# EAGLE design brd (EAGLE 8.1.0)
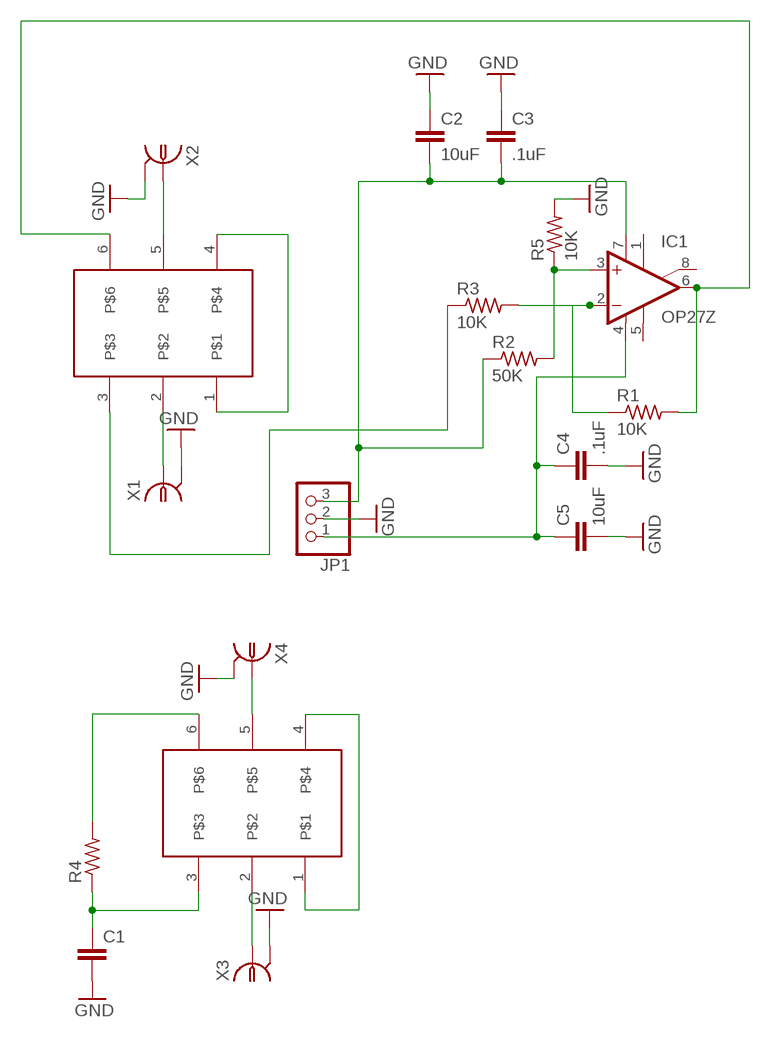
[diagram p0: schematic, sheet 1]

## Parts
C1  C-EU025-024X044  [C025-024X044]
C2  10uF  C-EU025-024X044  [C025-024X044]
C3  .1uF  C-EU025-024X044  [C025-024X044]
C4  .1uF  C-EU025-024X044  [C025-024X044]
C5  10uF  C-EU025-024X044  [C025-024X044]
IC1  OP27Z  [DIL08]
JP1  PINHD-1X3  [1X03]
R1  10K  R-US_0204/2V  [0204V]
R2  50K  R-US_0204/2V  [0204V]
R3  10K  R-US_0204/2V  [0204V]
R4  R-US_0204/2V  [0204V]
R5  10K  R-US_0204/2V  [0204V]
U$1  DP3T-TOGGLE  [7201MD9AV2BE]
U$2  DP3T-TOGGLE  [7201MD9AV2BE]
X1  BNC-H  [BNC90]
X2  BNC-H  [BNC90]
X3  BNC-H  [BNC90]
X4  BNC-H  [BNC90]

## Nets
GND: C1.2 C2.1 C3.1 C4.2 C5.2 JP1.2 R5.2 X1.2 X2.2 X3.2 X4.2
N$1: IC1.2(-IN) R1.1 R3.2
N$2: IC1.6(OUT) R1.2 U$1.6
N$3: C4.1 C5.1 IC1.4(V-) JP1.1
N$4: U$2.2 X3.1
N$5: U$2.5 X4.1
N$6: U$1.2 X1.1
N$7: C2.2 C3.2 IC1.7(V+) JP1.3 R2.1
N$8: C1.1 R4.1 U$2.3
N$9: IC1.3(+IN) R2.2 R5.1
N$10: U$2.1 U$2.4
N$12: U$1.5 X2.1
N$14: R3.1 U$1.3
N$15: U$1.1 U$1.4
N$16: R4.2 U$2.6
Unconnected: IC1.1(ON1) IC1.5(OPT) IC1.8(ON2)

## Library data of the parts
C1-C5 = resistor:C-EU: CAPACITOR, European symbol
IC1 = linear:OP27: OP AMP
JP1 = pinhead:PINHD-1X3: PIN HEADER
R1-R5 = resistor:R-US_: RESISTOR, American symbol
U$1 U$2 = switch-jqi:DP3T-TOGGLE
X1-X4 = connector-jqi:BNC: BNC Connector.; DIGIKEY: A32260-ND

## Board
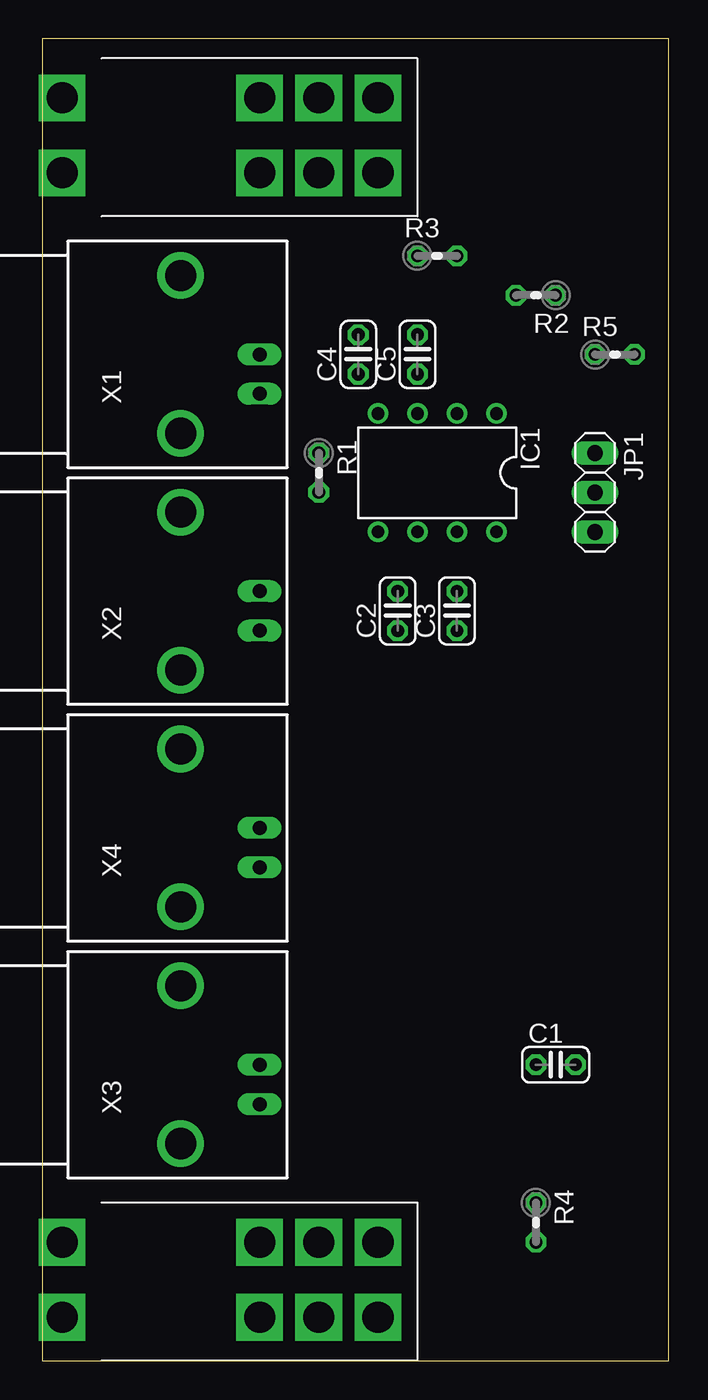
[diagram p1: board, top side]
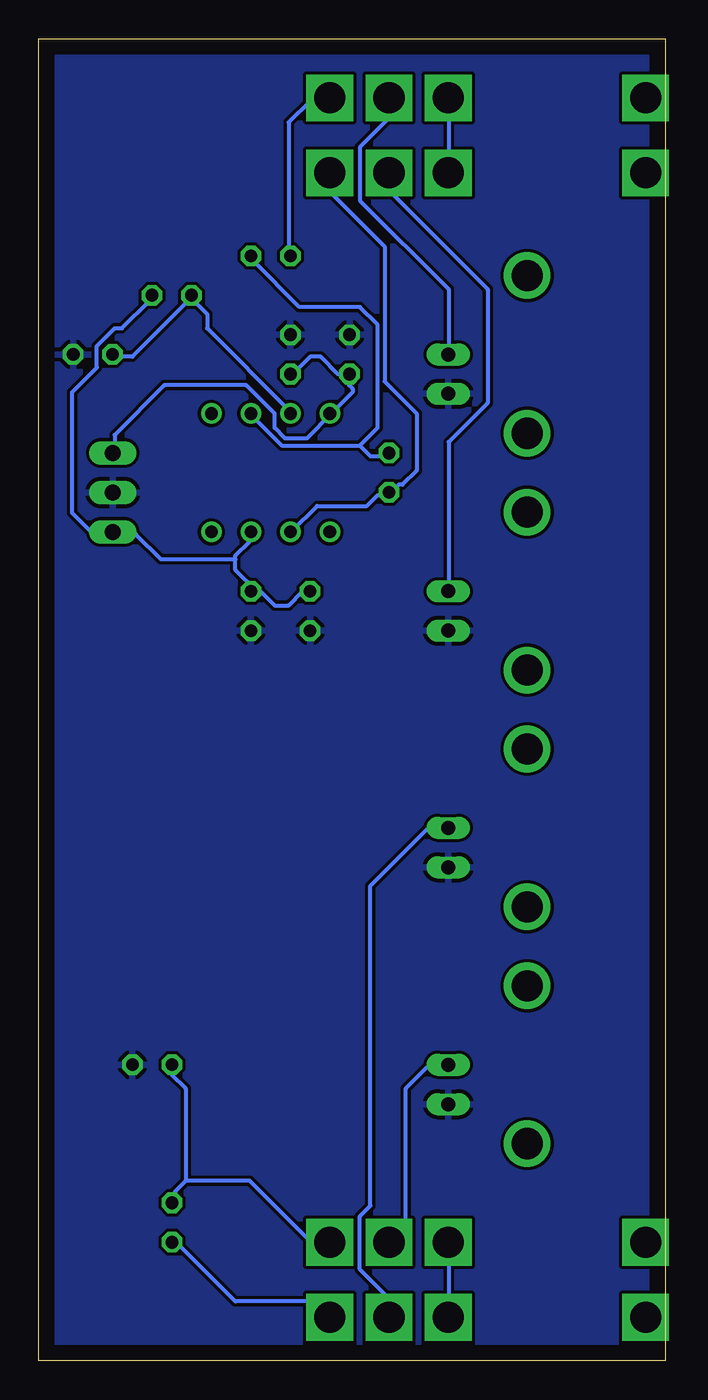
[diagram p2: board, bottom side, seen from below]

Size 40.31 x 85.08 mm. Coordinates in mm from the lower left corner, seen from the top.
Outline: 0,0 40.31,0 40.31,85.08 0,85.08 0,0
Copper layers (1*16): Top 0.035mm / dielectric 1.5mm / Bottom 0.035mm
Design rules "default": minimum track width 10mil, minimum drill 24mil, track to track 8mil, track to pad 8mil, pad to pad 8mil, via to via 8mil, smd to smd 8mil, copper to edge 40mil, drill to drill 8mil, minimum pad ring 10mil, minimum via ring 8mil, stop-mask expansion 4mil, vias tented up to drill 0mil, thermal gap 10mil

### Footprints (pad centres in the part's own frame; a part is rotated, then mirrored left to right if it is on the bottom)
C025-024X044 = drill 0.813 octagon: 1 -1.27,0; 2 1.27,0
DIL08 = drill 0.813 pad 1.27: 1 -3.81,-3.81; 2 -1.27,-3.81; 3 1.27,-3.81; 4 3.81,-3.81; 5 3.81,3.81; 6 1.27,3.81; 7 -1.27,3.81; 8 -3.81,3.81
1X03 = drill 1.016 long: 1 -2.54,0; 2 0,0; 3 2.54,0
0204V = drill 0.813 octagon: 1 -1.27,0; 2 1.27,0
7201MD9AV2BE = drill 2 square: 1 0,0; 2 0,3.81; 3 0,7.62; 4 4.826,0; 5 4.826,3.81; 6 4.826,7.62; P$7 0,-12.7; P$8 4.826,-12.7
BNC90 = drill 0.9 pad 1.27 long: 1 0,-5.08; 2 -2.54,-5.08 | drill 2 pad 2.032: ANCHOR1 -5.08,0; ANCHOR2 5.08,0

### Placement (x,y rotation side)
C1  33.02,19.05 0 top
C2  22.86,48.26 90 top
C3  26.67,48.26 90 top
C4  20.32,64.77 90 top
C5  24.13,64.77 90 top
IC1  25.4,57.15 180 top
JP1  35.56,55.88 270 top
R1  17.78,57.15 270 top
R2  31.75,68.58 180 top
R3  25.4,71.12 0 top
R4  31.75,8.89 270 top
R5  36.83,64.77 0 top
U$1  13.97,81.28 270 top
U$2  13.97,7.62 270 top
X1  8.89,64.77 90 top
X2  8.89,49.53 90 top
X3  8.89,19.05 90 top
X4  8.89,34.29 90 top

### Tracks (layer width: path | path; a pad name or v marks a point on that pad's centre or on a via)
GND
  pour Bottom: 0,85.09 40.64,85.09 40.64,0 0,0
N$1
  Bottom 0.254: 19.66,58.9 18.97,58.22 17.83,58.22 R1.1 | 19.66,58.9 24.69,58.9 26.75,60.96 IC1.2 | 19.66,58.9 18.52,60.05 18.52,66.67 19.66,67.82 23.55,67.82 26.52,70.79 26.52,71.02 R3.2
N$2
  Bottom 0.254: IC1.6 24,53.42 22.4,55.02 19.2,55.02 18.52,55.7 17.83,55.7 R1.2 17.6,55.93 17.14,56.39 16.92,56.39 16,57.3 16,60.96 18.06,63.02 18.06,71.7 21.49,75.13 21.49,76.28 U$1.6
N$3
  Bottom 0.254: 21.49,60.96 20.12,62.33 20.12,62.56 20.34,62.79 20.34,63.48 | 20.34,63.48 21.03,63.48 22.17,64.62 22.86,64.62 23.77,63.7 24,63.7 C5.1 | 20.34,63.48 C4.1 | 21.49,60.96 23.09,59.36 24.46,59.36 25.15,60.05 25.15,60.96 26.98,62.79 32.23,62.79 35.43,59.59 35.43,58.45 JP1.1 | 21.49,60.96 IC1.4
N$4
  Bottom 0.254: X3.1 14.17,18.9 15.32,18.9 16.69,17.53 16.69,8.61 17.6,7.7 U$2.2
N$5
  Bottom 0.254: X4.1 14.17,34.21 15.32,34.21 18.97,30.56 18.97,9.98 19.66,9.3 19.66,5.87 17.83,4.04 17.83,2.9 U$2.5
N$6
  Bottom 0.254: X1.1 13.95,64.85 13.95,68.96 19.66,74.68 19.66,78.1 17.83,79.93 17.83,81.08 U$1.2
N$7
  Bottom 0.254: C2.2 23.32,49.53 24.23,48.62 25.15,48.62 26.06,49.53 26.29,49.53 | 26.29,49.53 C3.2 26.52,49.53 | 27.66,51.59 27.66,50.9 26.29,49.53 | 27.66,51.59 27.66,51.82 26.75,52.73 26.75,53.19 IC1.7 | R2.1 33.15,68.5 33.15,68.27 34.98,66.45 35.43,66.45 36.58,65.3 36.58,63.93 38.18,62.33 38.18,54.56 37.03,53.42 35.66,53.42 JP1.3 35.43,53.19 34.06,53.19 32.46,51.59 27.66,51.59
N$8
  Bottom 0.254: 30.86,11.58 31.55,10.9 31.55,10.21 R4.1 | 30.86,11.58 30.86,17.53 31.77,18.44 31.77,18.9 C1.1 | 30.86,11.58 26.75,11.58 22.86,7.7 21.72,7.7 U$2.3
N$9
  Bottom 0.254: IC1.3 24.23,60.96 24.23,61.19 29.49,66.45 29.49,67.36 30.63,68.5 R2.2 30.4,68.5 34.29,64.62 35.43,64.62 R5.1
N$10
  Bottom 0.254: U$2.4 13.95,2.9 13.95,7.47 U$2.1
N$12
  Bottom 0.254: X2.1 13.95,49.53 13.95,59.13 11.43,61.65 11.43,68.96 17.6,75.13 17.6,76.28 U$1.5
N$14
  Bottom 0.254: R3.1 24.23,71.25 24.23,79.7 22.86,81.08 21.72,81.08 U$1.3
N$15
  Bottom 0.254: U$1.4 13.95,76.5 13.95,81.08 U$1.1
N$16
  Bottom 0.254: R4.2 31.55,7.47 31.32,7.47 27.66,3.81 22.63,3.81 21.72,2.9 U$2.6